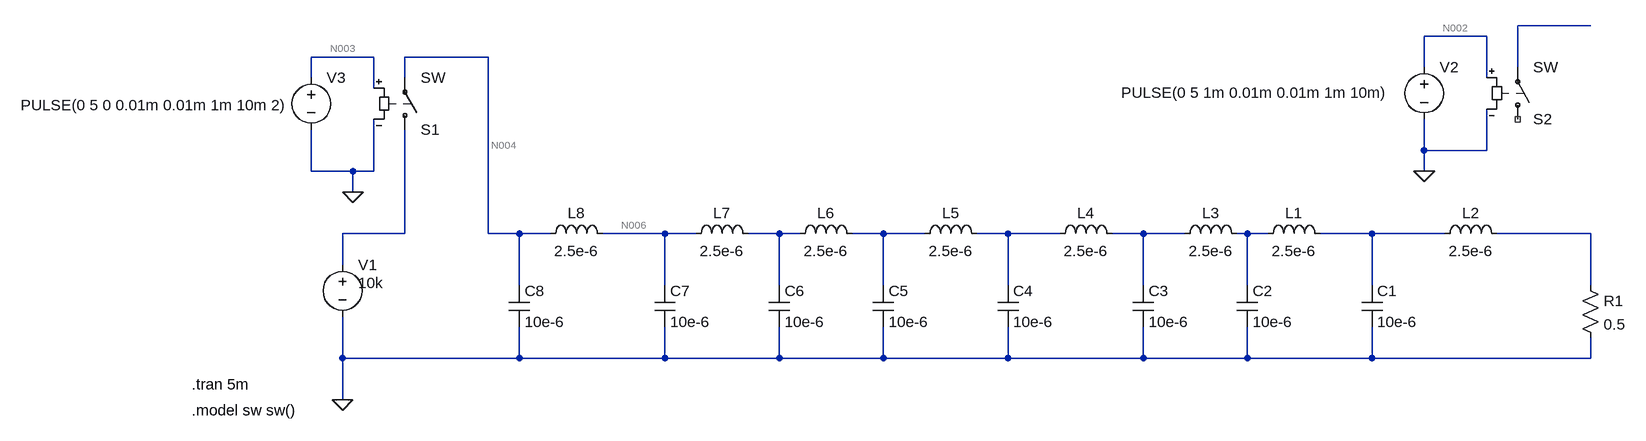
[diagram p0: schematic PFN_with_switch.asc]
PFN_with_switch.asc, the LTspice schematic file:
Version 4
SHEET 1 1260 680
WIRE 1200 -688 1088 -688
WIRE 1040 -672 944 -672
WIRE -672 -640 -768 -640
WIRE -496 -640 -624 -640
WIRE 944 -624 944 -672
WIRE 1088 -624 1088 -688
WIRE -768 -608 -768 -640
WIRE -624 -608 -624 -640
WIRE 1040 -608 1040 -672
WIRE -672 -592 -672 -640
WIRE 944 -496 944 -544
WIRE 1040 -496 1040 -560
WIRE 1040 -496 944 -496
WIRE -768 -464 -768 -528
WIRE -704 -464 -768 -464
WIRE -672 -464 -672 -544
WIRE -672 -464 -704 -464
WIRE 944 -464 944 -496
WIRE -704 -432 -704 -464
WIRE -624 -368 -624 -528
WIRE -624 -368 -720 -368
WIRE -496 -368 -496 -640
WIRE -448 -368 -496 -368
WIRE -400 -368 -448 -368
WIRE -224 -368 -320 -368
WIRE -176 -368 -224 -368
WIRE -48 -368 -96 -368
WIRE -16 -368 -48 -368
WIRE 112 -368 64 -368
WIRE 176 -368 112 -368
WIRE 304 -368 256 -368
WIRE 384 -368 304 -368
WIRE 512 -368 464 -368
WIRE 576 -368 512 -368
WIRE 672 -368 656 -368
WIRE 704 -368 672 -368
WIRE 864 -368 784 -368
WIRE 976 -368 864 -368
WIRE 1200 -368 1056 -368
WIRE -720 -320 -720 -368
WIRE -448 -288 -448 -368
WIRE -224 -288 -224 -368
WIRE -48 -288 -48 -368
WIRE 112 -288 112 -368
WIRE 304 -288 304 -368
WIRE 512 -288 512 -368
WIRE 672 -288 672 -368
WIRE 864 -288 864 -368
WIRE 1200 -288 1200 -368
WIRE -720 -176 -720 -240
WIRE -448 -176 -448 -224
WIRE -448 -176 -720 -176
WIRE -224 -176 -224 -224
WIRE -224 -176 -448 -176
WIRE -48 -176 -48 -224
WIRE -48 -176 -224 -176
WIRE 112 -176 112 -224
WIRE 112 -176 -48 -176
WIRE 304 -176 304 -224
WIRE 304 -176 112 -176
WIRE 512 -176 512 -224
WIRE 512 -176 304 -176
WIRE 672 -176 672 -224
WIRE 672 -176 512 -176
WIRE 864 -176 864 -224
WIRE 864 -176 672 -176
WIRE 1200 -176 1200 -208
WIRE 1200 -176 864 -176
WIRE -720 -112 -720 -176
FLAG -720 -112 0
FLAG 944 -464 0
FLAG -704 -432 0
DATAFLAG 1056 -176 ""
SYMBOL voltage 944 -640 R0
WINDOW 3 -466 55 Left 2
WINDOW 123 0 0 Left 0
WINDOW 39 0 0 Left 0
SYMATTR Value PULSE(0 5 1m 0.01m 0.01m 1m 10m)
SYMATTR InstName V2
SYMBOL sw 1088 -528 M180
SYMATTR InstName S2
SYMBOL voltage -720 -336 R0
WINDOW 3 24 44 Left 2
WINDOW 123 0 0 Left 0
WINDOW 39 0 0 Left 0
SYMATTR Value 10k
SYMATTR InstName V1
SYMBOL ind 688 -352 R270
WINDOW 0 32 56 VTop 2
WINDOW 3 5 56 VBottom 2
SYMATTR InstName L1
SYMATTR Value 2.5e-6
SYMBOL cap 848 -288 R0
SYMATTR InstName C1
SYMATTR Value 10e-6
SYMATTR SpiceLine IC=0
SYMBOL res 1184 -304 R0
SYMATTR InstName R1
SYMATTR Value 0.5
SYMBOL ind 960 -352 R270
WINDOW 0 32 56 VTop 2
WINDOW 3 5 56 VBottom 2
SYMATTR InstName L2
SYMATTR Value 2.5e-6
SYMBOL ind 560 -352 R270
WINDOW 0 32 56 VTop 2
WINDOW 3 5 56 VBottom 2
SYMATTR InstName L3
SYMATTR Value 2.5e-6
SYMBOL cap 656 -288 R0
SYMATTR InstName C2
SYMATTR Value 10e-6
SYMATTR SpiceLine IC=0
SYMBOL ind 368 -352 R270
WINDOW 0 32 56 VTop 2
WINDOW 3 5 56 VBottom 2
SYMATTR InstName L4
SYMATTR Value 2.5e-6
SYMBOL ind 160 -352 R270
WINDOW 0 32 56 VTop 2
WINDOW 3 5 56 VBottom 2
SYMATTR InstName L5
SYMATTR Value 2.5e-6
SYMBOL cap 496 -288 R0
SYMATTR InstName C3
SYMATTR Value 10e-6
SYMATTR SpiceLine IC=0
SYMBOL cap 288 -288 R0
SYMATTR InstName C4
SYMATTR Value 10e-6
SYMATTR SpiceLine IC=0
SYMBOL ind -32 -352 R270
WINDOW 0 32 56 VTop 2
WINDOW 3 5 56 VBottom 2
SYMATTR InstName L6
SYMATTR Value 2.5e-6
SYMBOL ind -192 -352 R270
WINDOW 0 32 56 VTop 2
WINDOW 3 5 56 VBottom 2
SYMATTR InstName L7
SYMATTR Value 2.5e-6
SYMBOL ind -416 -352 R270
WINDOW 0 32 56 VTop 2
WINDOW 3 5 56 VBottom 2
SYMATTR InstName L8
SYMATTR Value 2.5e-6
SYMBOL cap 96 -288 R0
SYMATTR InstName C5
SYMATTR Value 10e-6
SYMATTR SpiceLine IC=0
SYMBOL cap -64 -288 R0
SYMATTR InstName C6
SYMATTR Value 10e-6
SYMATTR SpiceLine IC=0
SYMBOL cap -240 -288 R0
SYMATTR InstName C7
SYMATTR Value 10e-6
SYMATTR SpiceLine IC=0
SYMBOL cap -464 -288 R0
SYMATTR InstName C8
SYMATTR Value 10e-6
SYMATTR SpiceLine IC=0
SYMBOL voltage -768 -624 R0
WINDOW 3 -447 58 Left 2
WINDOW 123 0 0 Left 0
WINDOW 39 0 0 Left 0
SYMATTR Value PULSE(0 5 0 0.01m 0.01m 1m 10m 2)
SYMATTR InstName V3
SYMBOL sw -624 -512 M180
SYMATTR InstName S1
TEXT -952 -136 Left 2 !.tran 5m
TEXT -952 -96 Left 2 !.model sw sw()

The netlist it stands for:
* PFN_with_switch.asc
V2 N002 0 PULSE(0 5 1m 0.01m 0.01m 1m 10m)
S2 NC_01 N001 N002 0 SW
V1 N005 0 10k
L1 N011 N012 2.5e-6
C1 N012 0 10e-6 IC=0
R1 N013 0 0.5
L2 N012 N013 2.5e-6
L3 N010 N011 2.5e-6
C2 N011 0 10e-6 IC=0
L4 N009 N010 2.5e-6
L5 N008 N009 2.5e-6
C3 N010 0 10e-6 IC=0
C4 N009 0 10e-6 IC=0
L6 N007 N008 2.5e-6
L7 N006 N007 2.5e-6
L8 N004 N006 2.5e-6
C5 N008 0 10e-6 IC=0
C6 N007 0 10e-6 IC=0
C7 N006 0 10e-6 IC=0
C8 N004 0 10e-6 IC=0
V3 N003 0 PULSE(0 5 0 0.01m 0.01m 1m 10m 2)
S1 N005 N004 N003 0 SW
.tran 5m
.model sw sw()
.backanno
.end

* Results of the author's LTspice run, read from the files saved beside the schematic
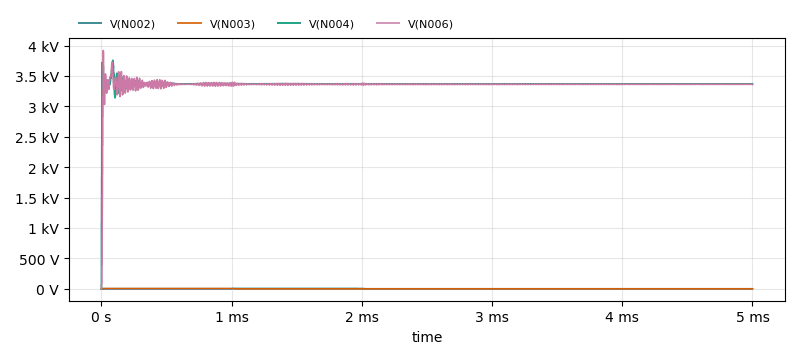
[diagram p1: Transient Analysis of PFN_with_switch.asc, plotted from the saved traces]
* Transient Analysis, 1 run:
*   V(N002): min 0 V, max 5 V, average 1.01 V, rms 2.244 V, last 0 V
*   V(N003): min 0 V, max 5 V, average 1.01 V, rms 2.244 V, last 0 V
*   V(N004): min 0 V, max 3.757 kV, average 3.368 kV, rms 3.369 kV, last 3.37 kV
*   V(N006): min 0 V, max 3.92 kV, average 3.358 kV, rms 3.361 kV, last 3.359 kV